# EAGLE design SPI_Backplane (EAGLE 9.6.2)
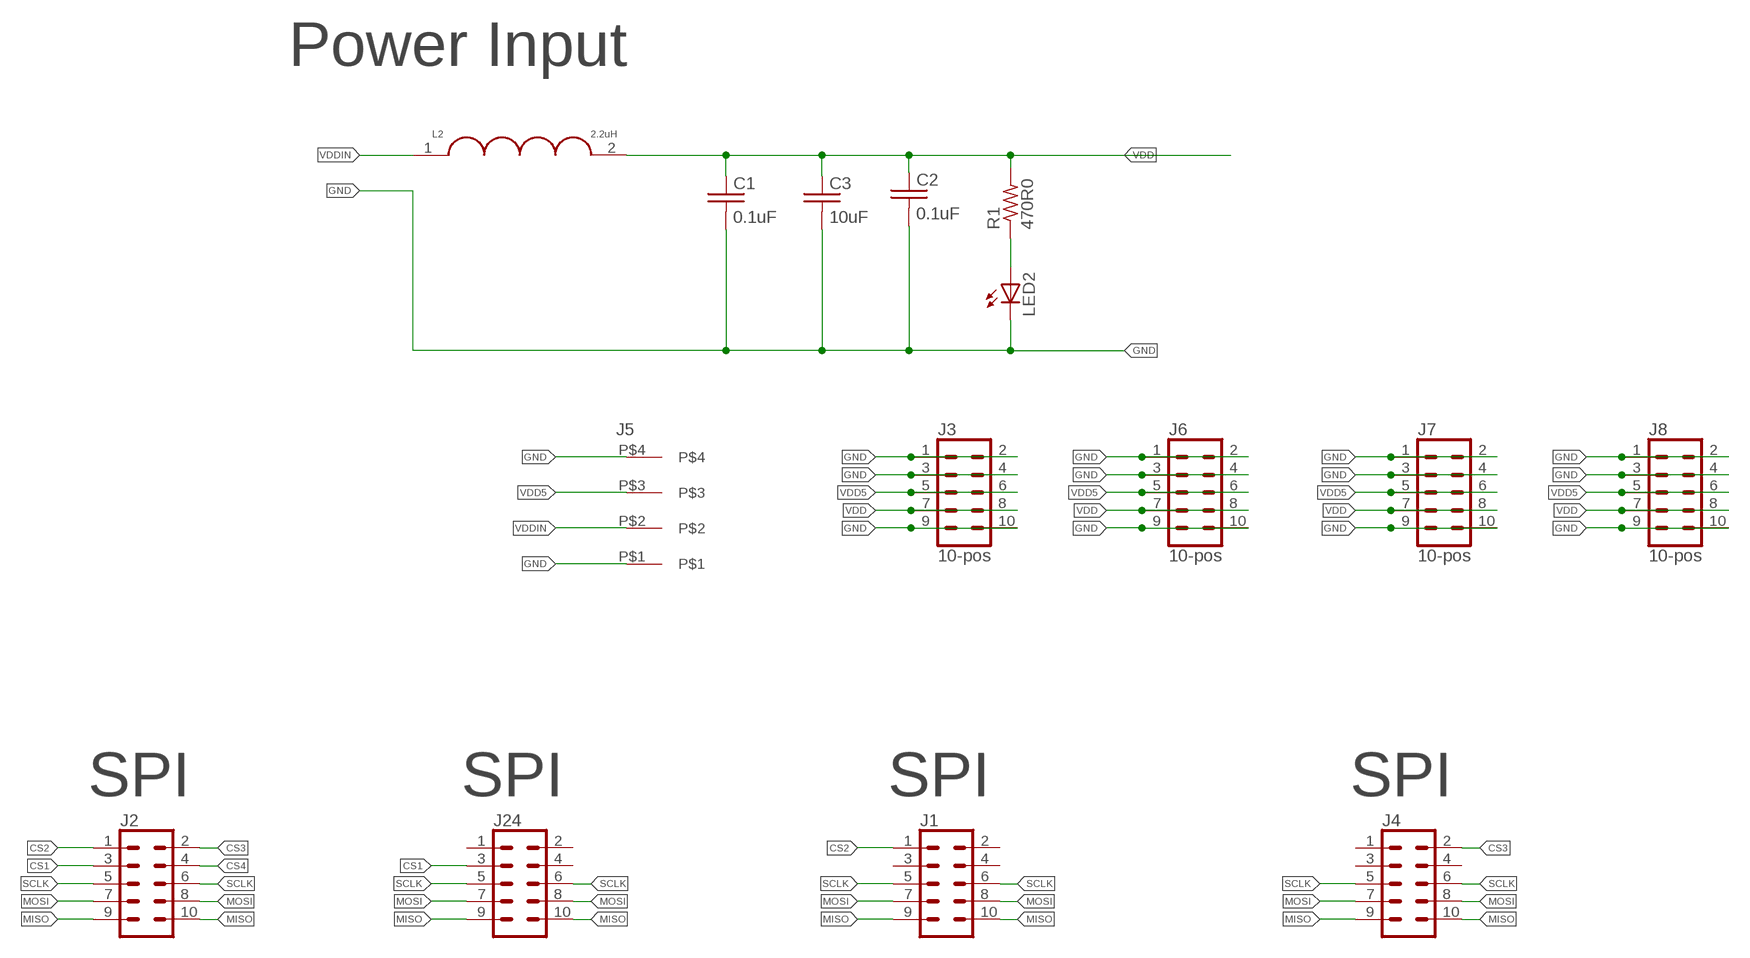
[diagram p0: schematic, sheet 1]

## Parts
C1  0.1uF  C_0402_0.1UF  [0402]
C2  0.1uF  C_0402_0.1UF  [0402]
C3  10uF  C_0402_10UF  [0402]
J1  CONN_05X2PTH  [2X5]
J2  CONN_05X2PTH  [2X5]
J3  10-pos  CONN_05X2_RAPTH  [2X5]
J4  CONN_05X2PTH  [2X5]
J5  4-pos  3.81MM_1_X_4_RT_ANGLE_PLUG_HEADER  [1X4_3.81MM_PITCH]
J6  10-pos  CONN_05X2_RAPTH  [2X5]
J7  10-pos  CONN_05X2_RAPTH  [2X5]
J8  10-pos  CONN_05X2_RAPTH  [2X5]
J24  CONN_05X2PTH  [2X5]
L2  2.2uH  INDUCTOR_1008_2.2_MH_1.3A  [1008]
LED2  Green  LED_0805_GREEN  [0805]
R1  470R0  R_0402_470R0  [0402]

## Nets
CS1: J2.3 J24.3
CS2: J1.1 J2.1
CS3: J2.2 J4.2
CS4: J2.4
GND: C1.P$2 C2.P$2 C3.P$2 J3.1 J3.2 J3.3 J3.4 J3.9 J3.10 J5.P$1 J5.P$4 J6.1 J6.2 J6.3 J6.4 J6.9 J6.10 J7.1 J7.2 J7.3 J7.4 J7.9 J7.10 J8.1 J8.2 J8.3 J8.4 J8.9 J8.10 LED2.2(C)
MISO: J1.9 J1.10 J2.9 J2.10 J4.9 J4.10 J24.9 J24.10
MOSI: J1.7 J1.8 J2.7 J2.8 J4.7 J4.8 J24.7 J24.8
N$1: LED2.1(A) R1.P$1
SCLK: J1.5 J1.6 J2.5 J2.6 J4.5 J4.6 J24.5 J24.6
VDD: C1.P$1 C2.P$1 C3.P$1 J3.7 J3.8 J6.7 J6.8 J7.7 J7.8 J8.7 J8.8 L2.2 R1.P$2
VDD5: J3.5 J3.6 J5.P$3 J6.5 J6.6 J7.5 J7.6 J8.5 J8.6
VDDIN: J5.P$2 L2.1
Unconnected: J1.2 J1.3 J1.4 J4.1 J4.3 J4.4 J24.1 J24.2 J24.4

## Notes on the sheet
- Power Input
- SPI | SPI | SPI | SPI

## Library data of the parts
C1 C2 = 3D_MIG_Controller:C_0402_0.1UF; PARTNO: CL05F104ZO5NNNC
C3 = 3D_MIG_Controller:C_0402_10UF; PARTNO: CL05A106MP8NUB8
J1 J2 J4 J24 = 3D_MIG_Controller:CONN_05X2: Multi connection point. Often used as Generic Header-pin footprint for 0.1 inch spaced/style header connections For AVR SPI programming port, see special device with nice symbol: "AVR_SPI_PROG_5x2.dev" You can populate with any combo of single row headers, but if you'd like an exact match, check these: 2x5 AVR ICSP Male Header <https://www.sparkfun.com/products/778> (PRT-00778) 2x5 Pin Shrouded Header <https://www.sparkfun.com/products/8506> (PRT-08506) On any of the 0.1 inch spaced packages, you can populate with these: Break Away Headers - Straight <https://www.sparkfun.com/products/116> (PRT-00116) Break Away Male Headers - Right Angle <https://www.sparkfun.com/products/553> (PRT-00553) Female Headers <https://www.sparkfun.com/products/115> (PRT-00115) Break Away Headers - Machine Pin <https://www.sparkfun.com/products/117> (PRT-00117) Break Away Female Headers - Swiss Machine Pin <https://www.sparkfun.com/products/743> (PRT-00743) Special note: the shrouded connector mates well with our 5x2 ribbon cables: 2x5 Pin IDC Ribbon Cable <https://www.sparkfun.com/products/8535> (PRT-08535); PROD_ID: CONN-08499; SF_ID: PRT-0778
J3 J6-J8 = 3D_MIG_Controller:CONN_05X2_RA: Connector Header Through Hole, Right Angle 10 position 0.100" (2.54mm); PARTNO: PH2RA-10-UA
J5 = 3D_MIG_Controller:3.81MM_1_X_4_RT_ANGLE_PLUG_HEADER: 4 Position Terminal Block Header, Male Pins, Shrouded (4 Side) 0.150" (3.81mm) 90°, Right Angle - Through Hole; PARTNO: 691322310004
L2 = 3D_MIG_Controller:INDUCTOR_1008_2.2_MH_1.3A; PARTNO: LQM2HPN2R2MG0L
LED2 = 3D_MIG_Controller:LED_0805_GREEN: Green 570nm LED Indication - Discrete 2.2V 0805 (2012 Metric); PARTNO: LG R971-KN-1
R1 = 3D_MIG_Controller:R_0402_470R0; PARTNO: RMCF0402JT470R

## Board
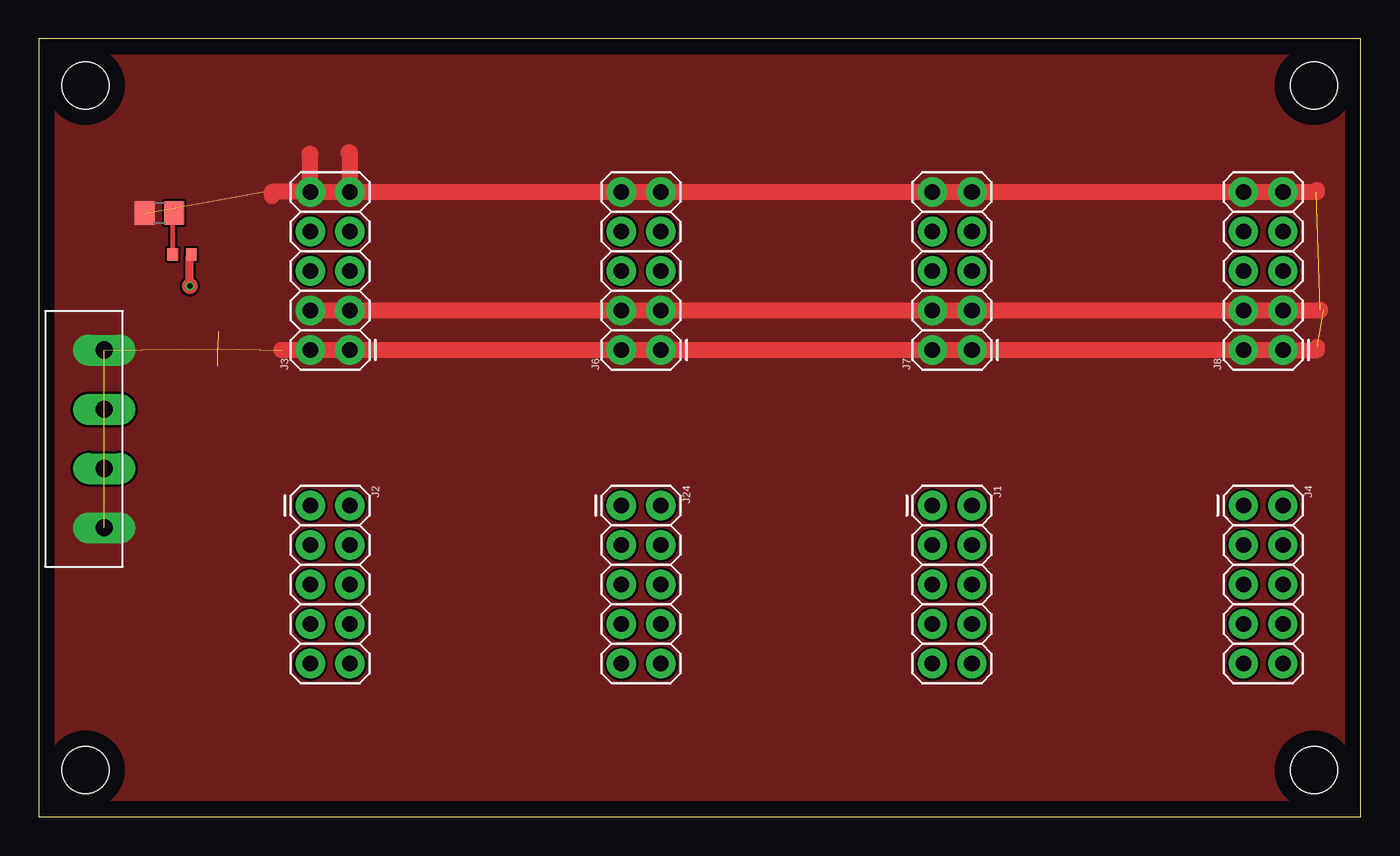
[diagram p1: board, top side]
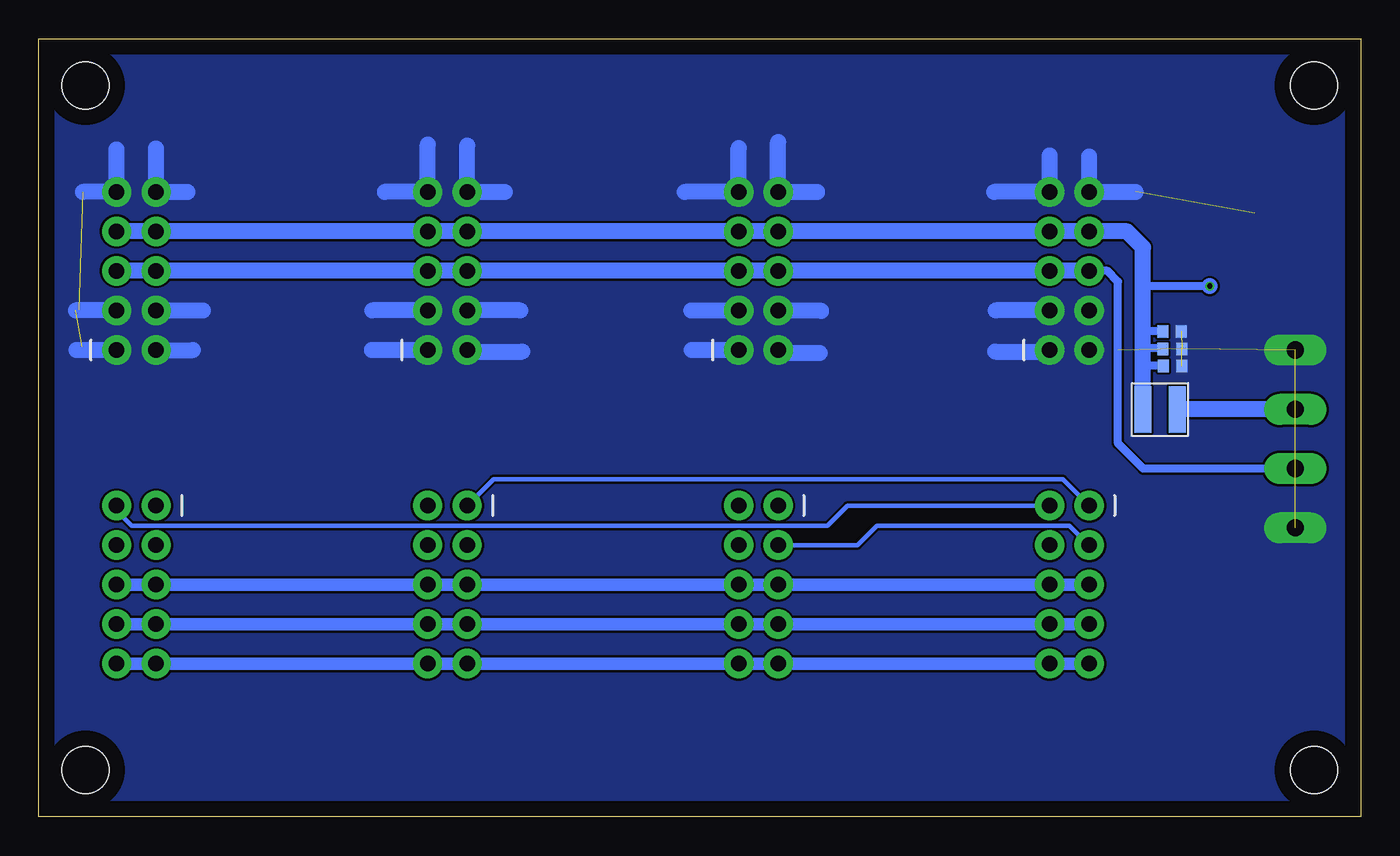
[diagram p2: board, bottom side, seen from below]

Size 85 x 50 mm. Coordinates in mm from the lower left corner, seen from the top.
Outline: 0,0 85,0 85,50 0,50 0,0
Copper layers (1*16): Top 0.035mm / dielectric 1.5mm / Bottom 0.035mm
Design rules "default": minimum track width 6mil, minimum drill 0.2mm, track to track 6mil, track to pad 6mil, pad to pad 6mil, via to via 6mil, smd to smd 6mil, copper to edge 40mil, drill to drill 6mil, minimum pad ring 10mil, minimum via ring 4mil, stop-mask expansion 4mil, vias tented up to drill 0mil, thermal gap 10mil
Holes 3 mm at 3,3 3,47 82,47 82,3

### Footprints (pad centres in the part's own frame; a part is rotated, then mirrored left to right if it is on the bottom)
0402 = smd 0.8 x 0.7: P$1 0,0.6; P$2 0,-0.6
2X5 = drill 1 pad 1.88: 1 0,0; 2 0,2.54; 3 2.54,0; 4 2.54,2.54; 5 5.08,0; 6 5.08,2.54; 7 7.62,0; 8 7.62,2.54; 9 10.16,0; 10 10.16,2.54
1X4_3.81MM_PITCH = drill 1.1 pad 2 long: P$1 0,0; P$2 3.81,0; P$3 7.62,0; P$4 11.43,0
1008 = smd 3 x 1.1: 1 0,1.1; 2 0,-1.1
0805 = smd 1.3 x 1.5: 1 -0.95,0; 2 0.95,0

### Placement (x,y rotation side)
C1  12.12,31.2 90 bottom
C2  12.09,28.97 90 bottom
C3  12.11,30.07 90 bottom
J1  57.46,20 270 top
J2  17.46,20 270 top
J3  20,30 90 top
J4  77.46,20 270 top
J5  4.2,30 270 top
J6  40,30 90 top
J7  60,30 90 top
J8  80,30 90 top
J24  37.46,20 270 top
L2  12.9,26.17 270 bottom
LED2  7.75,38.8 180 top
R1  9.21,36.15 90 top

### Tracks (layer width: path | path; a pad name or v marks a point on that pad's centre or on a via)
CS1
  Bottom 0.305: J2.3 18.71,18.7 31.11,18.7 32.36,17.46 J24.3
CS2
  Bottom 0.305: J2.1 19.16,21.7 55.76,21.7 J1.1
CS3
  Bottom 0.305: J2.2 33,20 34.28,18.71 79.02,18.71 80,19.7 J4.2
GND  (8 unrouted)
  Top 1.016: J3.10 17.46,42.6 17.4,42.6 | J3.9 20,42.7 19.9,42.7 | J3.10 15,40.16 15,39.9 | J3.10 J3.9 | J3.9 J6.10 J6.9 J7.10 J7.9 J8.10 J8.9 82.2,40.16 82.2,40.3 | J3.4 J3.3 J6.4 J6.3 J7.4 J7.3 J8.4 J8.3 82.4,32.54 82.4,32.6 | 82.2,30.2 82.2,30 J8.1 J8.2 J7.1 J7.2 J6.1 J6.2 J3.1 J3.2 15.6,30
  Bottom 1.016: J3.3 23.46,32.54 | 23.5,29.9 20.1,29.9 J3.1 | 23.56,40.16 J3.9 20,42.5 | 14.46,40.16 J3.10 17.46,42.44 | J6.4 34.74,32.54 34.7,32.5 | 34.8,29.8 37.26,29.8 J6.2 | J6.1 43,30 | 43.06,32.54 J6.3 | J7.3 63.54,32.54 | J7.2 57.36,29.9 53.9,29.9 | 54.04,32.54 J7.4 | 77.42,32.5 J8.4 74.44,32.54 | 82.16,40.16 J8.9 80,42.9 | 75.44,40.16 J8.10 77.46,42.96 | 62.76,40.16 J7.9 60,43.2 | 55.04,40.16 J7.10 57.46,43.16 | 43.46,40.16 J6.9 40,43 | 34.94,40.16 J6.10 37.46,43.36 | J8.3 82.62,32.54 | J8.1 82.58,30 | J8.2 75.1,30 | J7.1 63.6,30
  pour Bottom (no thermals): 0,50.1 85,50.1 85,0 0,0
  pour Top (no thermals): 0,50 85,50 85,0 0,0
MISO
  Bottom 0.813: J2.9 J2.10 J24.9 J24.10 J1.9 J1.10 J4.9 J4.10
MOSI
  Bottom 0.813: J2.7 J2.8 J24.7 J24.8 J1.7 J1.8 J4.7 J4.8
N$1
  Top 0.305: LED2.1 8.61,38.71 R1.P$1
SCLK
  Bottom 0.813: J2.5 J2.6 J24.5 J24.6 J1.5 J1.6 J4.5 J4.6
VDD  (via drill 0.35)
  Top 0.508: v9.7,34.1 9.7,36.04 R1.P$2
  Top 1.016: v9.7,34.1
  Bottom 0.254: 14.1,26.27 L2.2 14,24.97 | 12.7,31.22 C1.P$1 | 12.71,28.99 C2.P$1
  Bottom 0.508: C3.P$1 12.74,30.1 14,30.1 | 14.09,26.26 L2.2 | C2.P$1 12.72,29 14,29 | C1.P$1 13.9,31.2 14,31.1 | 9.74,34.06 v9.7,34.1 13.9,34.1 14,34.2
  Bottom 1.016: L2.2 14,29 14,30.1 14,31.1 14,34.2 14,36.6 15.02,37.62 J3.8 J3.7 J6.8 J6.7 J7.8 J7.7 J8.8 J8.7 | v9.7,34.1
VDD5
  Bottom 0.508: J5.P$3 13.98,22.38 15.6,24 15.6,34.4 16.28,35.08 J3.6
  Bottom 1.016: J3.6 J3.5 J6.6 J6.5 J7.6 J7.5 J8.6 J8.5
VDDIN
  Bottom 1.016: J5.P$2 11.78,26.19 L2.1